# EAGLE schematic UNO_Shield_PINS_1 (EAGLE 7.5.0)
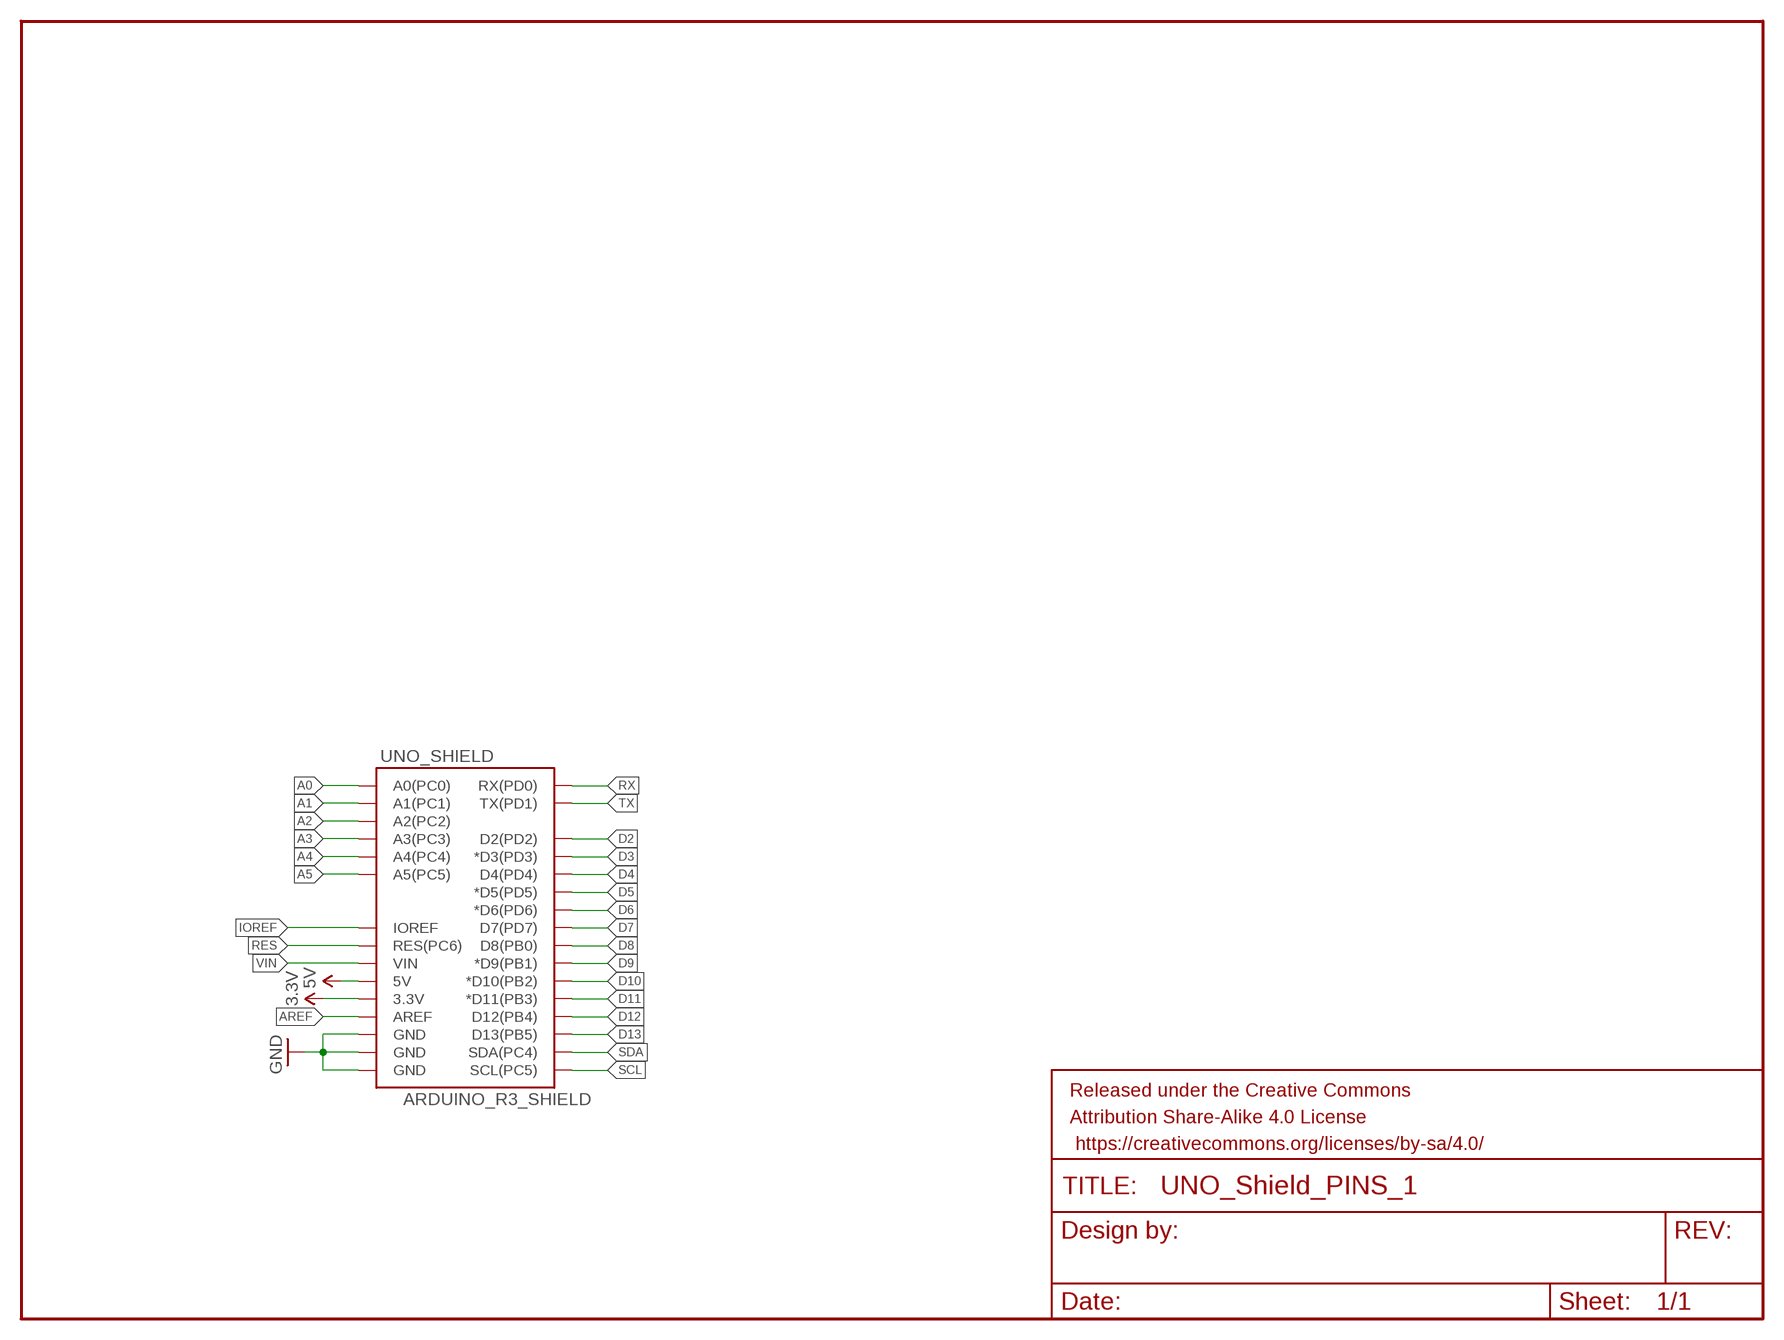
[diagram p0: schematic, sheet 1]

## Parts
FRAME1  FRAME-LETTER  [CREATIVE_COMMONS]
UNO_SHIELD  ARDUINO_R3_SHIELD  [UNO_R3_SHIELD]

## Nets
3.3V: UNO_SHIELD.3.3V
5V: UNO_SHIELD.5V
A0: UNO_SHIELD.A0(A0(PC0))
A1: UNO_SHIELD.A1(A1(PC1))
A2: UNO_SHIELD.A2(A2(PC2))
A3: UNO_SHIELD.A3(A3(PC3))
A4: UNO_SHIELD.A4(A4(PC4))
A5: UNO_SHIELD.A5(A5(PC5))
AREF: UNO_SHIELD.AREF
D2: UNO_SHIELD.D2(D2(PD2))
D3: UNO_SHIELD.D3(*D3(PD3))
D4: UNO_SHIELD.D4(D4(PD4))
D5: UNO_SHIELD.D5(*D5(PD5))
D6: UNO_SHIELD.D6(*D6(PD6))
D7: UNO_SHIELD.D7(D7(PD7))
D8: UNO_SHIELD.D8(D8(PB0))
D9: UNO_SHIELD.D9(*D9(PB1))
D10: UNO_SHIELD.D10(*D10(PB2))
D11: UNO_SHIELD.D11(*D11(PB3))
D12: UNO_SHIELD.D12(D12(PB4))
D13: UNO_SHIELD.D13(D13(PB5))
GND: UNO_SHIELD.GND@0(GND) UNO_SHIELD.GND@1(GND) UNO_SHIELD.GND@2(GND)
IOREF: UNO_SHIELD.IOREF
RES: UNO_SHIELD.RES(RES(PC6))
RX: UNO_SHIELD.RX(RX(PD0))
SCL: UNO_SHIELD.SCL(SCL(PC5))
SDA: UNO_SHIELD.SDA(SDA(PC4))
TX: UNO_SHIELD.TX(TX(PD1))
VIN: UNO_SHIELD.VIN

## Library data of the parts
FRAME1 = SparkFun-Aesthetics:FRAME-LETTER: Schematic Frame Standard 8.5x11 US Letter frame
UNO_SHIELD = Nathans-Arduinos:ARDUINO_R3_SHIELD: Shield form compatible with the Arduino Uno R3.